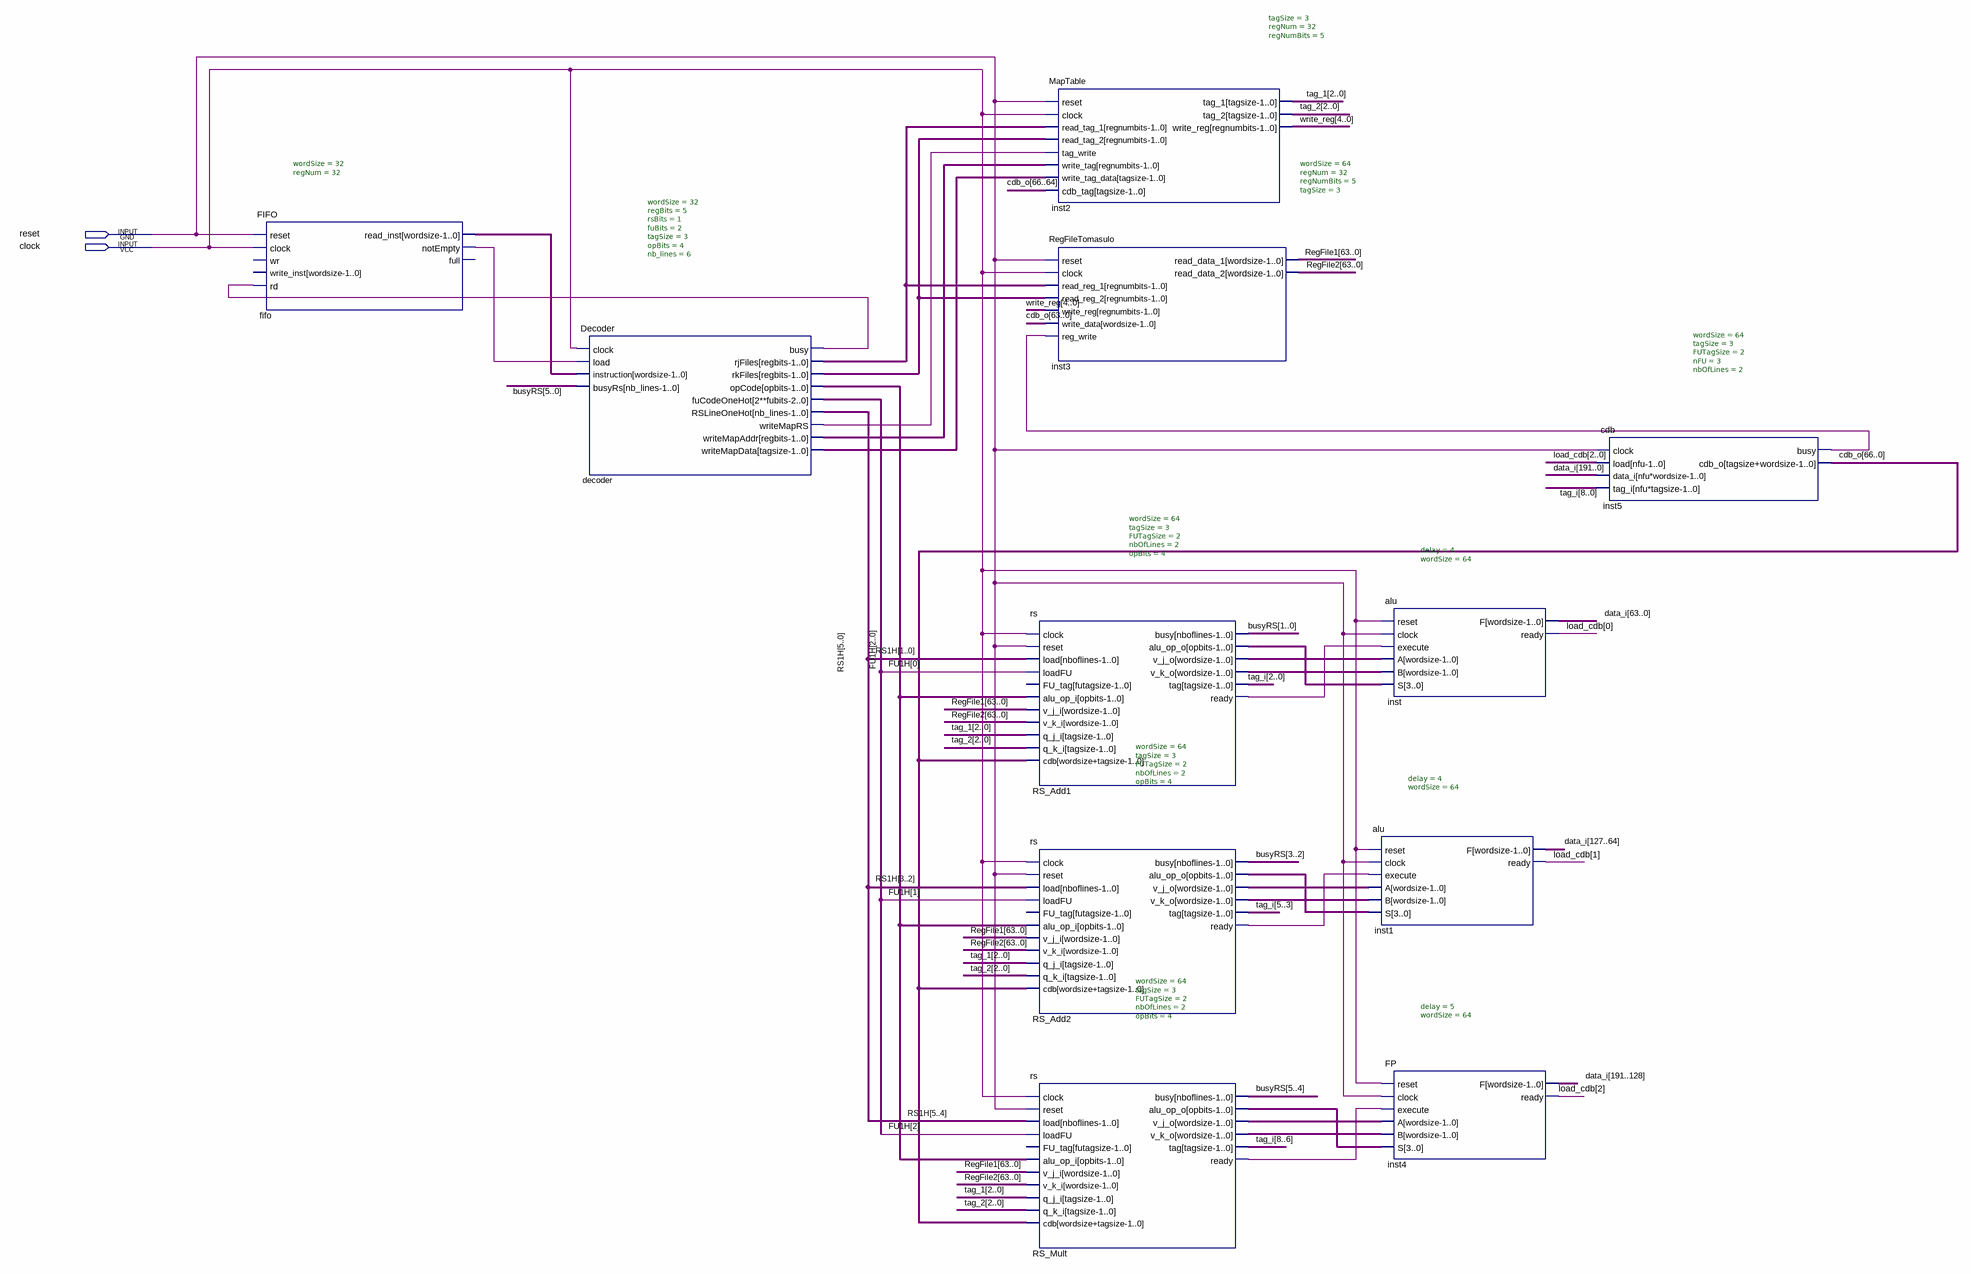
[diagram p0: schematic sheet]
// Quartus schematic Tomasulo.bdf as structural Verilog: 11 symbols, 2 pins
module Tomasulo (
  input  reset,
  input  clock
);

  wire decoder_busy, decoder_writemaprs, fifo_notempty, inst5_busy, RS_Add1_ready, RS_Add2_ready,
       RS_Mult_ready;
  wire [2:0] decoder_writemapdata, FU1H, load_cdb, tag_1, tag_2;
  wire [3:0] decoder_opcode, RS_Add1_alu_op_o, RS_Add2_alu_op_o, RS_Mult_alu_op_o;
  wire [4:0] decoder_rjfiles, decoder_rkfiles, decoder_writemapaddr, write_reg;
  wire [5:0] busyRS, RS1H;
  wire [8:0] tag_i;
  wire [31:0] fifo_read_inst;
  wire [63:0] RegFile1, RegFile2, RS_Add1_v_j_o, RS_Add1_v_k_o, RS_Add2_v_j_o, RS_Add2_v_k_o, RS_Mult_v_j_o,
       RS_Mult_v_k_o;
  wire [66:0] cdb_o;
  wire [191:0] data_i;

  FIFO #(.wordSize(32), .regNum(32)) fifo (
    .reset(reset), .clock(clock), .rd(decoder_busy), .read_inst(fifo_read_inst), .notEmpty(fifo_notempty));  // open: wr, write_inst, full
  Decoder #(.wordSize(32), .regBits(5), .rsBits(1), .fuBits(2), .tagSize(3), .opBits(4), .nb_lines(6)) decoder (
    .clock(clock), .load(fifo_notempty), .instruction(fifo_read_inst), .busyRs(busyRS), .busy(decoder_busy),
    .rjFiles(decoder_rjfiles), .rkFiles(decoder_rkfiles), .opCode(decoder_opcode), .fuCodeOneHot(FU1H),
    .RSLineOneHot(RS1H), .writeMapRS(decoder_writemaprs), .writeMapAddr(decoder_writemapaddr),
    .writeMapData(decoder_writemapdata));
  rs #(.wordSize(64), .tagSize(3), .FUTagSize(2), .nbOfLines(2), .opBits(4)) RS_Add1 (
    .clock(clock), .reset(reset), .load(RS1H[1:0]), .loadFU(FU1H[0]), .alu_op_i(decoder_opcode),
    .v_j_i(RegFile1), .v_k_i(RegFile2), .q_j_i(tag_1), .q_k_i(tag_2), .cdb(cdb_o), .busy(busyRS[1:0]),
    .alu_op_o(RS_Add1_alu_op_o), .v_j_o(RS_Add1_v_j_o), .v_k_o(RS_Add1_v_k_o), .tag(tag_i[2:0]),
    .ready(RS_Add1_ready));  // open: FU_tag
  rs #(.wordSize(64), .tagSize(3), .FUTagSize(2), .nbOfLines(2), .opBits(4)) RS_Add2 (
    .clock(clock), .reset(reset), .load(RS1H[3:2]), .loadFU(FU1H[1]), .alu_op_i(decoder_opcode),
    .v_j_i(RegFile1), .v_k_i(RegFile2), .q_j_i(tag_1), .q_k_i(tag_2), .cdb(cdb_o), .busy(busyRS[3:2]),
    .alu_op_o(RS_Add2_alu_op_o), .v_j_o(RS_Add2_v_j_o), .v_k_o(RS_Add2_v_k_o), .tag(tag_i[5:3]),
    .ready(RS_Add2_ready));  // open: FU_tag
  rs #(.wordSize(64), .tagSize(3), .FUTagSize(2), .nbOfLines(2), .opBits(4)) RS_Mult (
    .clock(clock), .reset(reset), .load(RS1H[5:4]), .loadFU(FU1H[2]), .alu_op_i(decoder_opcode),
    .v_j_i(RegFile1), .v_k_i(RegFile2), .q_j_i(tag_1), .q_k_i(tag_2), .cdb(cdb_o), .busy(busyRS[5:4]),
    .alu_op_o(RS_Mult_alu_op_o), .v_j_o(RS_Mult_v_j_o), .v_k_o(RS_Mult_v_k_o), .tag(tag_i[8:6]),
    .ready(RS_Mult_ready));  // open: FU_tag
  MapTable #(.tagSize(3), .regNum(32), .regNumBits(5)) inst2 (
    .reset(reset), .clock(clock), .read_tag_1(decoder_rjfiles), .read_tag_2(decoder_rkfiles),
    .tag_write(decoder_writemaprs), .write_tag(decoder_writemapaddr), .write_tag_data(decoder_writemapdata),
    .cdb_tag(cdb_o[66:64]), .tag_1(tag_1), .tag_2(tag_2), .write_reg(write_reg));
  RegFileTomasulo #(.wordSize(64), .regNum(32), .regNumBits(5), .tagSize(3)) inst3 (
    .reset(reset), .clock(clock), .read_reg_1(decoder_rjfiles), .read_reg_2(decoder_rkfiles),
    .write_reg(write_reg), .write_data(cdb_o[63:0]), .reg_write(inst5_busy), .read_data_1(RegFile1),
    .read_data_2(RegFile2));
  alu #(.delay(4), .wordSize(64)) inst (
    .reset(clock), .clock(reset), .execute(RS_Add1_ready), .A(RS_Add1_v_j_o), .B(RS_Add1_v_k_o),
    .S(RS_Add1_alu_op_o), .F(data_i[63:0]), .ready(load_cdb[0]));
  alu #(.delay(4), .wordSize(64)) inst1 (
    .reset(clock), .clock(reset), .execute(RS_Add2_ready), .A(RS_Add2_v_j_o), .B(RS_Add2_v_k_o),
    .S(RS_Add2_alu_op_o), .F(data_i[127:64]), .ready(load_cdb[1]));
  FP #(.delay(5), .wordSize(64)) inst4 (
    .reset(clock), .clock(reset), .execute(RS_Mult_ready), .A(RS_Mult_v_j_o), .B(RS_Mult_v_k_o),
    .S(RS_Mult_alu_op_o), .F(data_i[191:128]), .ready(load_cdb[2]));
  cdb #(.wordSize(64), .tagSize(3), .FUTagSize(2), .nFU(3), .nbOfLines(2)) inst5 (
    .clock(reset), .load(load_cdb), .data_i(data_i), .tag_i(tag_i), .busy(inst5_busy), .cdb_o(cdb_o));
endmodule
